# Altium project biointerfaceController_pcb.PrjPcb
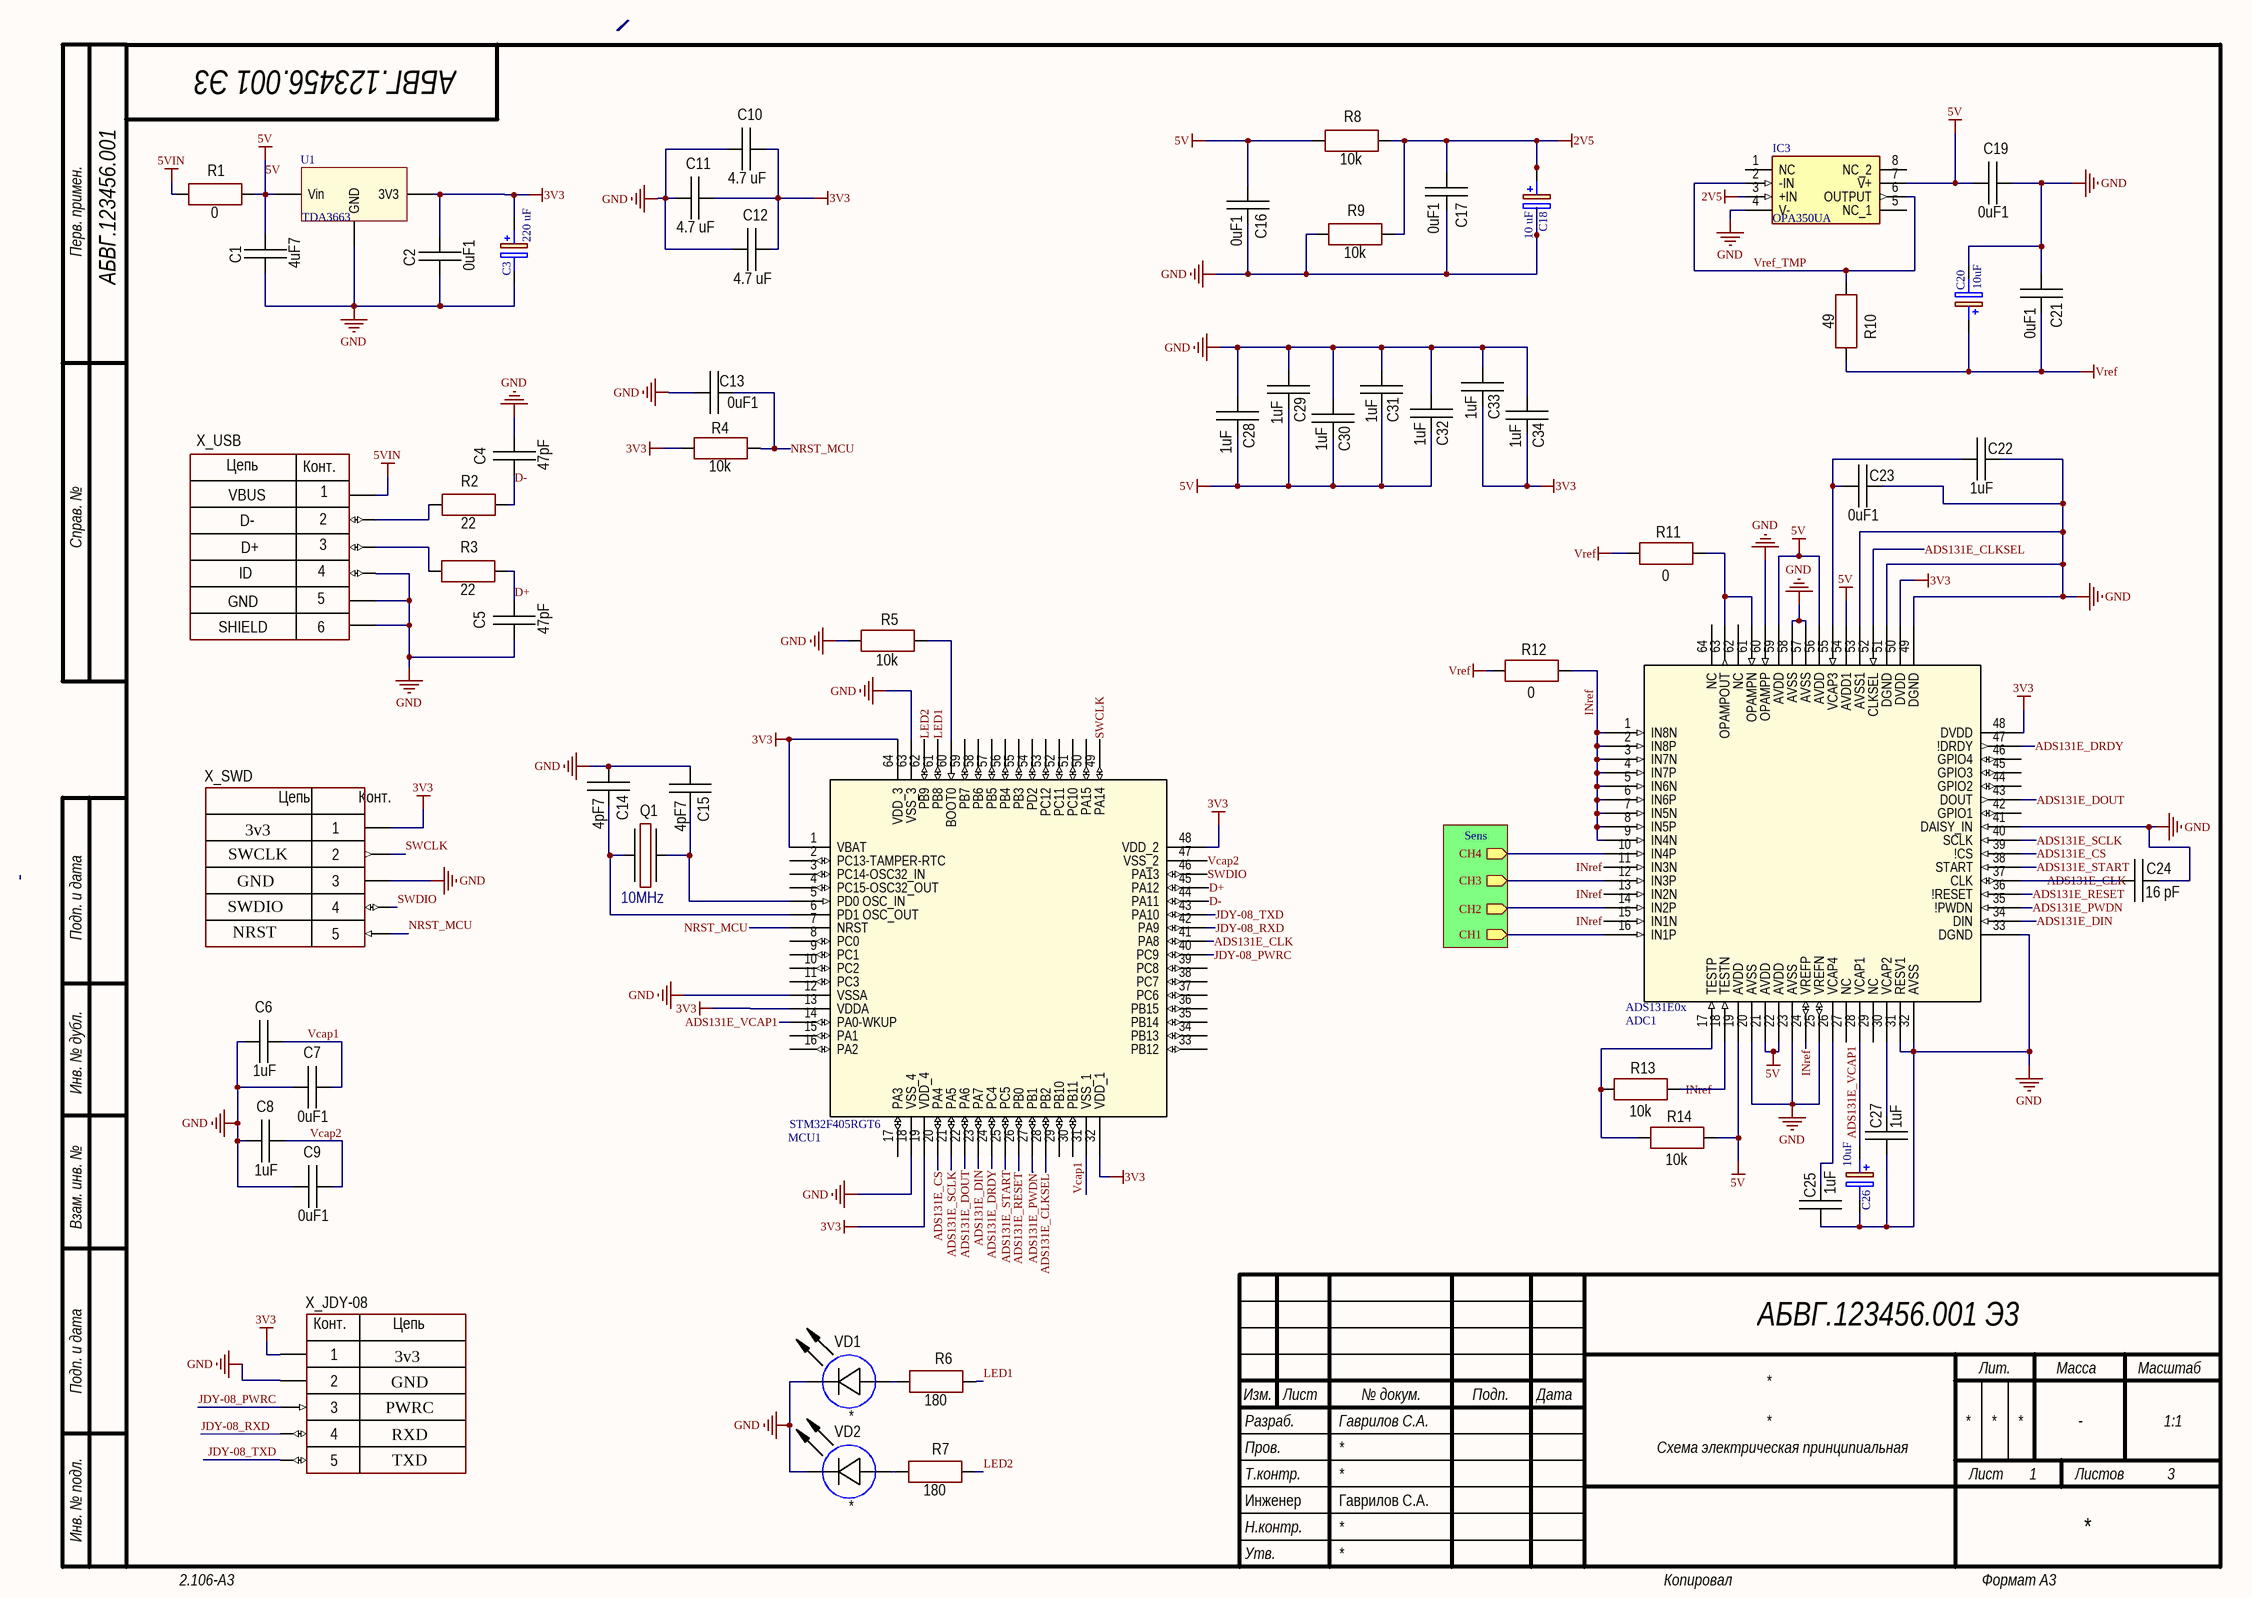
[diagram p0: biointerfaceController_pcb.SchDoc]
2 sheets, 105 parts. Net scope: hierarchical (ports join the sheet entries above them; power ports are global).
Board file: biointerfaceController_pcb.PcbDoc
Sheets:
  biointerfaceController_pcb.SchDoc
    Sens = biointerfaceController_pcb_Sens.SchDoc

## Sheet biointerfaceController_pcb.SchDoc
size 420 x 297 mm; Author: Гаврилов С.А.; Engineer: Инженер; Address1: Address1; Address2: Address2; Address3: Address3; Address4: Address4; DocumentNumber: АБВГ.123456.001 Э3; SheetNumber: 1; SheetTotal: 3; Scale: 1:1; EngineerName: Гаврилов С.А.; DocumentType: Схема электрическая принципиальная; Mass: -; FirstReferrence: АБВГ.123456.001

### Parts
ADC1  ADS131E0x  [LQFP64_L]
C1  4uF7  [SMD-1206C]
C2  0uF1  [SMD-0603C]
C3  220 uF  [TANTAL_C_6032X280N]
C4  47pF  [SMD-0402C]
C5  47pF  [SMD-0402C]
C6  1uF  [SMD-0603C]
C7  0uF1  [SMD-0603C]
C8  1uF  [SMD-0603C]
C9  0uF1  [SMD-0603C]
C10  4.7 uF  [SMD-0603C]
C11  4.7 uF  [SMD-0603C]
C12  4.7 uF  [SMD-0603C]
C13  0uF1  [SMD-0603C]
C14  4pF7  [SMD-0402C]
C15  4pF7  [SMD-0402C]
C16  0uF1  [SMD-0603C]
C17  0uF1  [SMD-0603C]
C18  10 uF  [TANTAL_C_6032X280N]
C19  0uF1  [SMD-0603C]
C20  10uF  [TANTAL_C_6032X280N]
C21  0uF1  [SMD-0603C]
C22  1uF  [SMD-0603C]
C23  0uF1  [SMD-0603C]
C24  16 pF  [CH0402C]
C25  1uF  [SMD-0603C]
C26  10uF  [TANTAL_C_6032X280N]
C27  1uF  [SMD-0603C]
C28  1uF  [SMD-0603C]
C29  1uF  [SMD-0603C]
C30  1uF  [SMD-0603C]
C31  1uF  [SMD-0603C]
C32  1uF  [SMD-0603C]
C33  1uF  [SMD-0603C]
C34  1uF  [SMD-0603C]
IC3  OPA350UA  [SOIC127P600X175-8N]
MCU1  STM32F405RGT6  [LQFP64_L]
Q1  10MHz  [OSC3225]
R1  0  [CH0805R]
R2  22  [CH0402R]
R3  22  [CH0402R]
R4  10k  [CH0402R]
R5  10k  [CH0402R]
R6  180  [CH0402R]
R7  180  [CH0402R]
R8  10k  [CH0402R]
R9  10k  [CH0402R]
R10  49  [CH0402R]
R11  0  [CH0402R]
R12  0  [CH0402R]
R13  10k  [CH0402R]
R14  10k  [CH0402R]
U1  TDA3663  [SOT-223-2]
VD1  *  [CH0805LB]
VD2  *  [CH0805LB]
X_JDY-08  Pin1: 3v3  Pin2: GND  Pin3: PWRC  Pin4: RXD  Pin5: TXD  [PBS-5]  (hidden comment: SWD)
X_SWD  Pin1: 3v3  Pin2: SWCLK  Pin3: GND  Pin4: SWDIO  Pin5: NRST  [HDRV4W64P0X254_1X5_1016X254X550P]  (hidden comment: SWD)
X_USB  USB  [mini_USB_A_5P]  (value not drawn)

### Sub-sheets
Sens = biointerfaceController_pcb_Sens.SchDoc: CH1 (out), CH2 (out), CH3 (out), CH4 (out)

### Nets
2V5: C17.1 C18.1(+) IC3.3(+IN) R8.2 R9.2
3V3: ADC1.48(DVDD) ADC1.50(DVDD) C2.2 C3.1(+) C10.2 C11.2 C12.2 C33.2 C34.2 MCU1.1(VBAT) MCU1.13(VDDA) MCU1.19(VDD_4) MCU1.32(VDD_1) MCU1.48(VDD_2) MCU1.64(VDD_3) R4.2 U1.3(3V3) X_SWD.1
5V: ADC1.19(AVDD) ADC1.21(AVDD) ADC1.22(AVDD) ADC1.54(AVDD1) ADC1.56(AVDD) ADC1.59(AVDD) C1.2 C16.1 C19.1 C28.2 C29.2 C30.2 C31.2 C32.2 IC3.7(V+) R1.2 R8.1 R14.2 U1.1(Vin)
5VIN: R1.1 X_USB.1
GND: ADC1.20(AVSS) ADC1.23(AVSS) ADC1.25(VREFN) ADC1.31(RESV1) ADC1.32(AVSS) ADC1.33(DGND) ADC1.41(DAISY_IN) ADC1.49(DGND) ADC1.51(DGND) ADC1.53(AVSS1) ADC1.57(AVSS) ADC1.58(AVSS) ADC1.60(OPAMPP) C1.1 C2.1 C3.2(-) C4.2 C5.1 C6.1 C7.1 C8.1 C9.1 C10.1 C11.1 C12.1 C13.2 C14.1 C15.1 C16.2 C17.2 C18.2(-) C19.2 C20.2(-) C21.1 C22.2 C23.2 C24.2 C25.1 C26.2(-) C27.1 C28.1 C29.1 C30.1 C31.1 C32.1 C33.1 C34.1 IC3.4(V-) MCU1.12(VSSA) MCU1.18(VSS_4) MCU1.63(VSS_3) R5.2 R9.1 U1.2(GND) VD1.2(C) VD2.2(C) X_JDY-08.2 X_SWD.3 X_USB.4 X_USB.5 X_USB.6
Vref: C20.1(+) C21.2 R10.2 R11.1 R12.1
ADS131E_CLK: ADC1.37(CLK) C24.1 MCU1.41(PA8)
ADS131E_CLKSEL: ADC1.52(CLKSEL) MCU1.28(PB2)
ADS131E_CS: ADC1.39(!CS) MCU1.20(PA4)
ADS131E_DIN: ADC1.34(DIN) MCU1.23(PA7)
ADS131E_DOUT: ADC1.43(DOUT) MCU1.22(PA6)
ADS131E_DRDY: ADC1.47(!DRDY) MCU1.24(PC4)
ADS131E_PWDN: ADC1.35(!PWDN) MCU1.27(PB1)
ADS131E_RESET: ADC1.36(!RESET) MCU1.26(PB0)
ADS131E_SCLK: ADC1.40(SCLK) MCU1.21(PA5)
ADS131E_START: ADC1.38(START) MCU1.25(PC5)
ADS131E_VCAP1: ADC1.28(VCAP1) C26.1(+) MCU1.14(PA0-WKUP)
D+: C5.2 MCU1.45(PA12) R3.2
D-: C4.1 MCU1.44(PA11) R2.2
INref: ADC1.1(IN8N) ADC1.2(IN8P) ADC1.3(IN7N) ADC1.4(IN7P) ADC1.5(IN6N) ADC1.6(IN6P) ADC1.7(IN5N) ADC1.8(IN5P) ADC1.9(IN4N) ADC1.11(IN3N) ADC1.13(IN2N) ADC1.15(IN1N) ADC1.18(TESTN) ADC1.24(VREFP) R12.2 R13.2
JDY-08_PWRC: MCU1.40(PC9) X_JDY-08.3
JDY-08_RXD: MCU1.42(PA9) X_JDY-08.4
JDY-08_TXD: MCU1.43(PA10) X_JDY-08.5
LED1: MCU1.61(PB8) R6.1
LED2: MCU1.62(PB9) R7.1
NRST_MCU: C13.1 MCU1.7(NRST) R4.1 X_SWD.5
SWCLK: MCU1.49(PA14) X_SWD.2
SWDIO: MCU1.46(PA13) X_SWD.4
Vcap1: C6.2 C7.2 MCU1.31(VSS_1)
Vcap2: C8.2 C9.2 MCU1.47(VSS_2)
Vref_TMP: IC3.2(-IN) IC3.6(OUTPUT) R10.1
NetADC1_10: ADC1.10(IN4P) ; sheet Sens/CH4
NetADC1_12: ADC1.12(IN3P) ; sheet Sens/CH3
NetADC1_14: ADC1.14(IN2P) ; sheet Sens/CH2
NetADC1_16: ADC1.16(IN1P) ; sheet Sens/CH1
NetADC1_17: ADC1.17(TESTP) R13.1 R14.1
NetADC1_26: ADC1.26(VCAP4) C25.2
NetADC1_30: ADC1.30(VCAP2) C27.2
NetADC1_55: ADC1.55(VCAP3) C22.1 C23.1
NetADC1_61: ADC1.61(OPAMPN) ADC1.63(OPAMPOUT) R11.2
NetC14_2: C14.2 MCU1.6(PD1_OSC_OUT) Q1.1
NetC15_2: C15.2 MCU1.5(PD0_OSC_IN) Q1.3
NetMCU1_60: MCU1.60(BOOT0) R5.1
NetR2_1: R2.1 X_USB.2
NetR3_1: R3.1 X_USB.3
NetR6_2: R6.2 VD1.1(A)
NetR7_2: R7.2 VD2.1(A)

Not connected (* = marked no-connect by the designer): ADC1 27(NC) 29(NC) 42(GPIO1) 44(GPIO2) 45(GPIO3) 46(GPIO4) 62(NC) 64(NC); IC3 1(NC) 5(NC_1) 8(NC_2); MCU1 2(PC13-TAMPER-RTC) 3(PC14-OSC32_IN) 4(PC15-OSC32_OUT) 8(PC0) 9(PC1) 10(PC2) 11(PC3) 15(PA1) 16(PA2) 17(PA3) 29(PB10) 30(PB11) 33(PB12) 34(PB13) 35(PB14) 36(PB15) 37(PC6) 38(PC7) 39(PC8) 50(PA15) 51(PC10) 52(PC11) 53(PC12) 54(PD2) 55(PB3) 56(PB4) 57(PB5) 58(PB6) 59(PB7); U1 4(GND); X_JDY-08 1

### Notes on the sheet
- Labels drawn without touching a wire or pin: 3V3
- Перв. примен.
- Справ. №
- Подп. и дата
- Инв. № дубл.
- Взам. инв. №
- Разраб.
- Изм.
- Лист
- № докум.
- Подп.
- Дата
- Лит.
- Масса
- Масштаб
- Пров.
- Т.контр.
- Листов
- Инв. № подл.
- Утв.
- Н.контр.
- 2.106-A3
- Копировал
- Формат А3
- (in symbol JDY-8) Конт.; Цепь
- (in symbol SWD) Цепь; Конт.
- (in symbol USB_5P) Цепь; Конт.; VBUS; D-; D+; ID; GND; SHIELD

### Library data of the parts
ADC1 = ADS131E0x: Manufacture: Texas Instruments; Manufacturer_Part_Number: ADS131E0x; Type: ADC; URL: https://www.ti.com/lit/ds/symlink/ads131e06.pdf?ts=1633684000052&ref_url=https%253A%252F%252Fwww.google.com%252F
C1 C2 C4-C17 C19 C21-C25 C27-C34 = Capacitor: Manufacturer: *; Model: *; HelpURL: *; ComponentKind: *
  C1: Value: 4uF7
  C2 C7 C9 C13 C16 C17 C19 C21 C23: Value: 0uF1
  C4 C5: Value: 47pF
  C6 C8 C22 C25 C27-C34: Value: 1uF
  C10-C12: Value: 4.7 uF
  C14 C15: Value: 4pF7
  C24: Value: 16 pF
C3 C18 C20 C26 = Tantal: Capacitor Polarised Tantal
  C3: Value: 220 uF
  C18: Value: 10 uF
  C20 C26: Value: 10uF
IC3 = OPA350UA: Integrated Circuit; Manufacturer_Name: Texas Instruments; Datasheet Link: http://www.ti.com/lit/ds/symlink/opa350.pdf; Height: 1.75mm; Manufacturer_Part_Number: OPA350UA; Mouser Part Number: 595-OPA350UA; Mouser Price/Stock: https://www.mouser.com/Search/Refine.aspx?Keyword=595-OPA350UA; RS Part Number: 4618790P; RS Price/Stock: http://uk.rs-online.com/web/p/products/4618790P
MCU1 = STM32F405RGT6: Manufacture: STMicroelectronics; Memory: 1024 Kb; Manufacturer_Part_Number: STM32F405RGT6; Type: MCU; URL: https://www.st.com/b/content/st_com/en/products/microcontrollers-microprocessors/stm32-32-bit-arm-cortex-mcus/stm32-high-performance-mcus/stm32f4-series/stm32f405-415/stm32f405rg.html#tools-software
Q1 = Oscillator: Manufacturer: *; Model: *; HelpURL: *; ComponentKind: *; Value: 10MHz
R1-R14 = Resistor: Manufacturer: *; Model: *; HelpURL: *; ComponentKind: *
  R1 R11 R12: Value: 0
  R2 R3: Value: 22
  R4 R5 R8 R9 R13 R14: Value: 10k
  R6 R7: Value: 180
  R10: Value: 49
VD1 VD2 = LED: Manufacturer: *; Model: *; HelpURL: *; ComponentKind: *; Value: *
X_JDY-08 = JDY-8: Model: SWD; Manufacturer: *; HelpURL: *; ComponentKind: *
X_USB = USB_5P: Manufacturer: *; HelpURL: *; ComponentKind: *; Model: *
U1 = TDA3663: Model: TDA3663; Manafacture: *; URL: *
X_SWD = SWD: Model: SWD; Manufacturer: *; HelpURL: *; ComponentKind: *

## Sheet biointerfaceController_pcb_Sens.SchDoc
size 420 x 297 mm; Author: Гаврилов С.А; Engineer: Инженер; Address1: Address1; Address2: Address2; Address3: Address3; Address4: Address4; DocumentNumber: АБВГ.123456.001 Э3; SheetNumber: 2; SheetTotal: 3; Scale: 1:1; EngineerName: Гаврилов С.А.; DocumentType: Схема электрическая принципиальная; Mass: -; FirstReferrence: АБВГ.123456.001
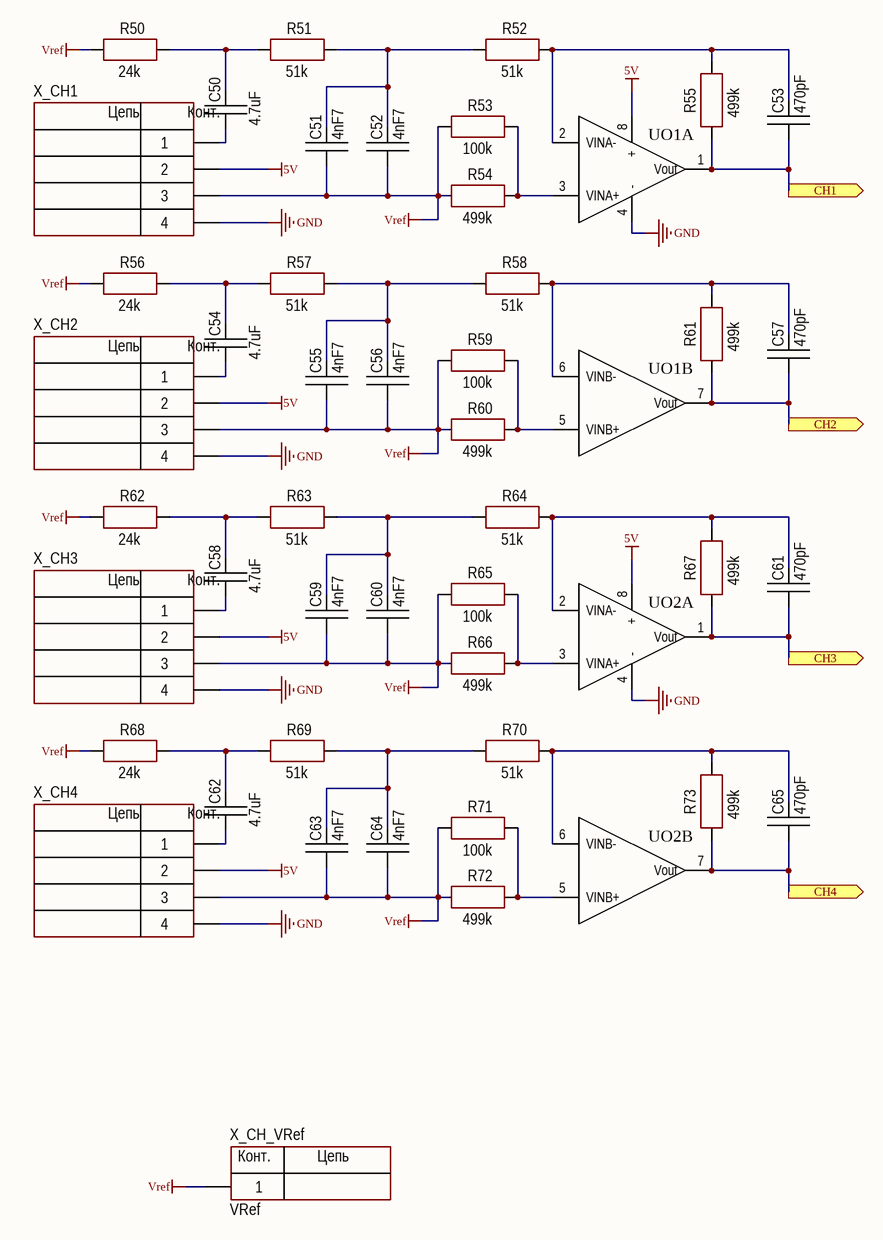
[diagram p1: biointerfaceController_pcb_Sens.SchDoc]

### Parts
C50  4.7uF  [SMD-1206C]
C51  4nF7  [CH0402C]
C52  4nF7  [CH0402C]
C53  470pF  [CH0402C]
C54  4.7uF  [SMD-1206C]
C55  4nF7  [CH0402C]
C56  4nF7  [CH0402C]
C57  470pF  [CH0402C]
C58  4.7uF  [SMD-1206C]
C59  4nF7  [CH0402C]
C60  4nF7  [CH0402C]
C61  470pF  [CH0402C]
C62  4.7uF  [SMD-1206C]
C63  4nF7  [CH0402C]
C64  4nF7  [CH0402C]
C65  470pF  [CH0402C]
R50  24k  [CH0402R]
R51  51k  [CH0402R]
R52  51k  [CH0402R]
R53  100k  [CH0402R]
R54  499k  [CH0402R]
R55  499k  [CH0402R]
R56  24k  [CH0402R]
R57  51k  [CH0402R]
R58  51k  [CH0402R]
R59  100k  [CH0402R]
R60  499k  [CH0402R]
R61  499k  [CH0402R]
R62  24k  [CH0402R]
R63  51k  [CH0402R]
R64  51k  [CH0402R]
R65  100k  [CH0402R]
R66  499k  [CH0402R]
R67  499k  [CH0402R]
R68  24k  [CH0402R]
R69  51k  [CH0402R]
R70  51k  [CH0402R]
R71  100k  [CH0402R]
R72  499k  [CH0402R]
R73  499k  [CH0402R]
UO1  MCP6L02T-E/MS  [SOP65P490X110-8N]  (value not drawn)  (parts A,B of 2)
UO2  MCP6L02T-E/MS  [SOP65P490X110-8N]  (value not drawn)  (parts A,B of 2)
X_CH1  *  [JSTIC_Molex_125]  (value not drawn)
X_CH2  *  [JSTIC_Molex_125]  (value not drawn)
X_CH3  *  [JSTIC_Molex_125]  (value not drawn)
X_CH4  *  [JSTIC_Molex_125]  (value not drawn)
X_CH_VRef  VRef  [CON: PADS 1x1mm]

### Ports
CH1 (out), CH2 (out), CH3 (out), CH4 (out)

### Nets
5V: UO1.8(+) UO2.8(+) X_CH1.2 X_CH2.2 X_CH3.2 X_CH4.2
GND: UO1.4(-) UO2.4(-) X_CH1.4 X_CH2.4 X_CH3.4 X_CH4.4
Vref: C51.1 C52.1 C55.1 C56.1 C59.1 C60.1 C63.1 C64.1 R50.1 R53.1 R54.1 R56.1 R59.1 R60.1 R62.1 R65.1 R66.1 R68.1 R71.1 R72.1 X_CH1.3 X_CH2.3 X_CH3.3 X_CH4.3 X_CH_VRef.1
NetADC1_10: C65.1 R73.1 UO2.7(Vout) ; port CH4
NetADC1_12: C61.1 R67.1 UO2.1(Vout) ; port CH3
NetADC1_14: C57.1 R61.1 UO1.7(Vout) ; port CH2
NetADC1_16: C53.1 R55.1 UO1.1(Vout) ; port CH1
NetC50_1: C50.1 X_CH1.1
NetC50_2: C50.2 R50.2 R51.1
NetC51_2: C51.2 C52.2 R51.2 R52.1
NetC53_2: C53.2 R52.2 R55.2 UO1.2(VINA-)
NetC54_1: C54.1 X_CH2.1
NetC54_2: C54.2 R56.2 R57.1
NetC55_2: C55.2 C56.2 R57.2 R58.1
NetC57_2: C57.2 R58.2 R61.2 UO1.6(VINB-)
NetC58_1: C58.1 X_CH3.1
NetC58_2: C58.2 R62.2 R63.1
NetC59_2: C59.2 C60.2 R63.2 R64.1
NetC61_2: C61.2 R64.2 R67.2 UO2.2(VINA-)
NetC62_1: C62.1 X_CH4.1
NetC62_2: C62.2 R68.2 R69.1
NetC63_2: C63.2 C64.2 R69.2 R70.1
NetC65_2: C65.2 R70.2 R73.2 UO2.6(VINB-)
NetR53_2: R53.2 R54.2 UO1.3(VINA+)
NetR59_2: R59.2 R60.2 UO1.5(VINB+)
NetR65_2: R65.2 R66.2 UO2.3(VINA+)
NetR71_2: R71.2 R72.2 UO2.5(VINB+)

### Notes on the sheet
- Перв. примен.
- Справ. №
- Подп. и дата
- Инв. № дубл.
- Взам. инв. №
- Разраб.
- Изм.
- Лист
- № докум.
- Подп.
- Дата
- Лит.
- Масса
- Масштаб
- Пров.
- Т.контр.
- Листов
- Инв. № подл.
- Утв.
- Н.контр.
- 2.106-A3
- Копировал
- Формат А3
- (in symbol 1-Connector) Конт.; Цепь
- (in symbol Connector-4) Цепь; Конт.

### Library data of the parts
C50-C65 = Capacitor: Manufacturer: *; Model: *; HelpURL: *; ComponentKind: *
  C50 C54 C58 C62: Value: 4.7uF
  C51 C52 C55 C56 C59 C60 C63 C64: Value: 4nF7
  C53 C57 C61 C65: Value: 470pF
R50-R73 = Resistor: Manufacturer: *; Model: *; HelpURL: *; ComponentKind: *
  R50 R56 R62 R68: Value: 24k
  R51 R52 R57 R58 R63 R64 R69 R70: Value: 51k
  R53 R59 R65 R71: Value: 100k
  R54 R55 R60 R61 R66 R67 R72 R73: Value: 499k
UO1 UO2 = MCP6L02T-E/MS: Vendor: Microchip; Built_By: EMA_UL_Team; Manufacturer_Part_Number: MCP6L02T-E/MS; Copyright: Copyright (C) 2018 Accelerated Designs. All rights reserved; RefDes: RefDes; Type: DEV; Value: Value
X_CH1-X_CH4 = Connector-4: Model: *; Manufacturer: *; HelpURL: *; ComponentKind: *
X_CH_VRef = 1-Connector: Model: *; Manufacturer: *; HelpURL: *; ComponentKind: *

## Nets that join several sheets
5V: biointerfaceController_pcb (19 pins), biointerfaceController_pcb_Sens (6 pins)
GND: biointerfaceController_pcb (61 pins), biointerfaceController_pcb_Sens (6 pins)
Vref: biointerfaceController_pcb (5 pins), biointerfaceController_pcb_Sens (25 pins)
NetADC1_10: biointerfaceController_pcb (ADC1.10), biointerfaceController_pcb_Sens (C65.1 R73.1 UO2.7)
NetADC1_12: biointerfaceController_pcb (ADC1.12), biointerfaceController_pcb_Sens (C61.1 R67.1 UO2.1)
NetADC1_14: biointerfaceController_pcb (ADC1.14), biointerfaceController_pcb_Sens (C57.1 R61.1 UO1.7)
NetADC1_16: biointerfaceController_pcb (ADC1.16), biointerfaceController_pcb_Sens (C53.1 R55.1 UO1.1)